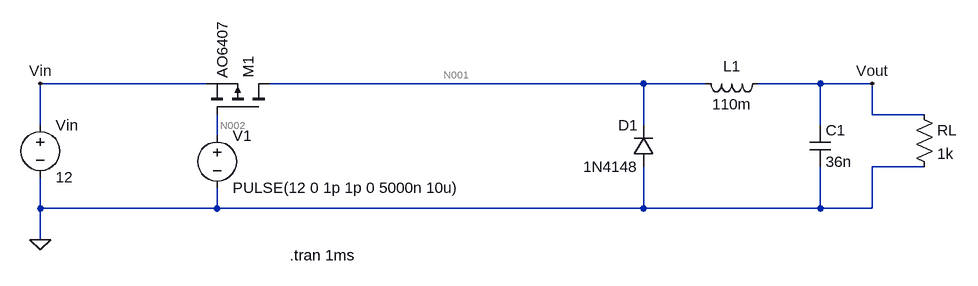
[diagram p0: schematic Buck4.asc]
Buck4.asc, the LTspice schematic file:
Version 4
SHEET 1 880 680
WIRE -368 48 -624 48
WIRE 304 48 -272 48
WIRE 400 48 304 48
WIRE 576 48 480 48
WIRE 656 48 576 48
WIRE 656 96 656 48
WIRE 736 96 656 96
WIRE -624 112 -624 48
WIRE 304 112 304 48
WIRE 576 112 576 48
WIRE -352 128 -352 96
WIRE 736 176 656 176
WIRE -624 240 -624 192
WIRE -352 240 -352 208
WIRE -352 240 -624 240
WIRE 304 240 304 176
WIRE 304 240 -352 240
WIRE 576 240 576 176
WIRE 576 240 304 240
WIRE 656 240 656 176
WIRE 656 240 576 240
WIRE -624 288 -624 240
FLAG -624 288 0
FLAG 656 48 Vout
FLAG -624 48 Vin
SYMBOL voltage -624 96 R0
WINDOW 123 0 0 Left 0
WINDOW 39 0 0 Left 0
SYMATTR InstName Vin
SYMATTR Value 12
SYMBOL voltage -352 112 R0
WINDOW 123 0 0 Left 0
WINDOW 39 0 0 Left 0
SYMATTR InstName V1
SYMATTR Value PULSE(12 0 1p 1p 0 5000n 10u)
SYMBOL pmos -272 96 M270
SYMATTR InstName M1
SYMATTR Value AO6407
SYMBOL diode 320 176 R180
WINDOW 0 24 64 Left 2
WINDOW 3 24 0 Left 2
SYMATTR InstName D1
SYMATTR Value 1N4148
SYMBOL ind 496 32 R90
WINDOW 0 5 56 VBottom 2
WINDOW 3 32 56 VTop 2
SYMATTR InstName L1
SYMATTR Value 110m
SYMBOL res 720 80 R0
SYMATTR InstName RL
SYMATTR Value 1k
SYMBOL cap 560 112 R0
SYMATTR InstName C1
SYMATTR Value 36n
TEXT -240 312 Left 2 !.tran 1ms

The netlist it stands for:
* Buck4.asc
Vin Vin 0 12
V1 N002 0 PULSE(12 0 1p 1p 0 5000n 10u)
M1 N001 N002 Vin Vin AO6407
D1 0 N001 1N4148
L1 Vout N001 110m
RL Vout 0 1k
C1 Vout 0 36n
.model D D
.lib standard.dio
.model NMOS NMOS
.model PMOS PMOS
.lib standard.mos
.tran 1ms
.backanno
.end

* Results of the author's LTspice run, read from the files saved beside the schematic
* Operating Point, zero values left out:
*   V(vin) = 12 V
*   V(n002) = 12 V
*   V(n001) = 18.05 µV
*   V(vout) = 18.05 µV
*   Id(M1) = -18.04 nA
*   Is(M1) = 18.04 nA
*   I(D1) = -1.004 pA
*   I(L1) = -18.05 nA
*   I(Rl) = 18.05 nA
*   I(Vin) = -18.05 nA